# Altium schematic sheet [01] - COVER PAGE.SchDoc
size A4; Date: 07/05/2016; CheckedBy: Javier Jiménez Pérez; Author: Javier Jiménez; CompanyName: Guilletronic; Engineer: Javier Jiménez Pérez; Organization: Guilletronic; Address1: Calle del Cel Nº14; Address2: Las Colinas; Address3: 08818 Olivella; DocumentNumber: 1; Revision: A; SheetNumber: 1; SheetTotal: 6
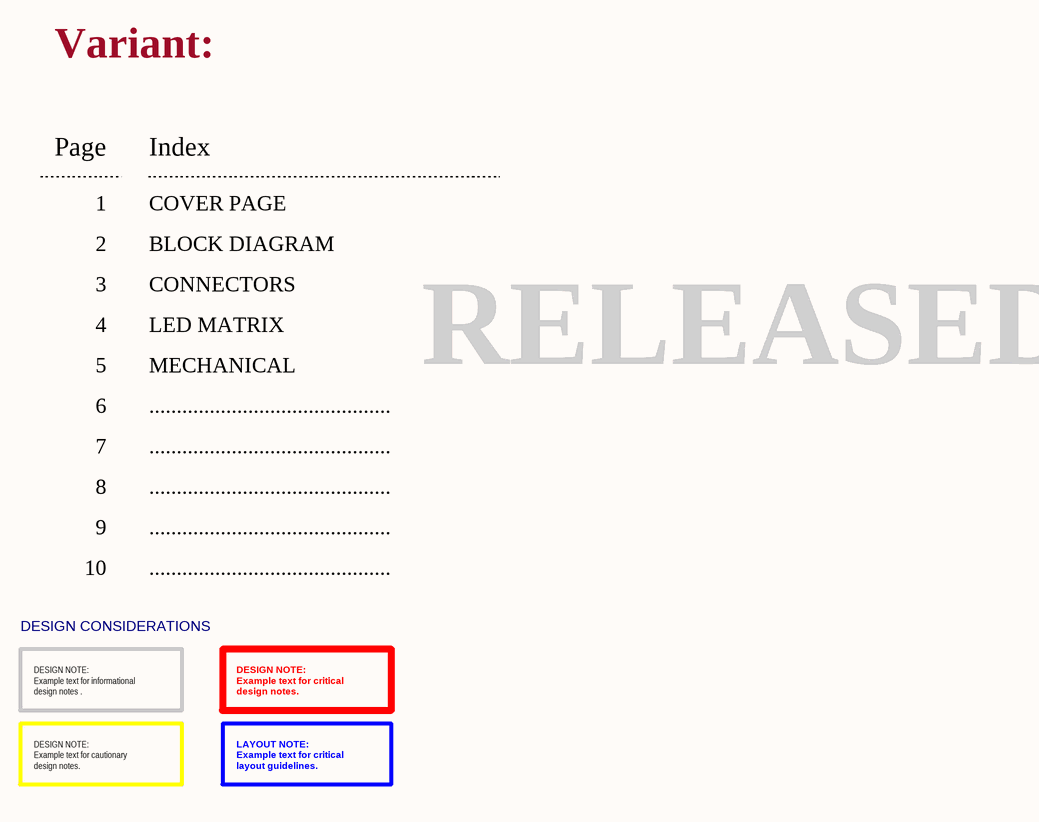
[diagram p0: [01] - COVER PAGE.SchDoc]

## Notes on the sheet
- Variant:
- Page
- Index
- 1
- 2
- COVER PAGE
- BLOCK DIAGRAM
- 3
- 4
- CONNECTORS
- LED MATRIX
- 5
- MECHANICAL
- RELEASED
- 6
- 7
- ............................................
- 8
- 9
- 10
- DESIGN CONSIDERATIONS
- DESIGN NOTE:
  Example text for informational
  design notes .
- DESIGN NOTE:
  Example text for critical
  design notes.
- DESIGN NOTE:
  Example text for cautionary
  design notes.
- LAYOUT NOTE:
  Example text for critical
  layout guidelines.
- Title
- Size:
- Date:
- Created:
- A4
- Number:
- Time:
- Modified:
- Revision:
- Sheet
- of
- Author:
- File: